# EAGLE design VNC2 (EAGLE 7.6.0)
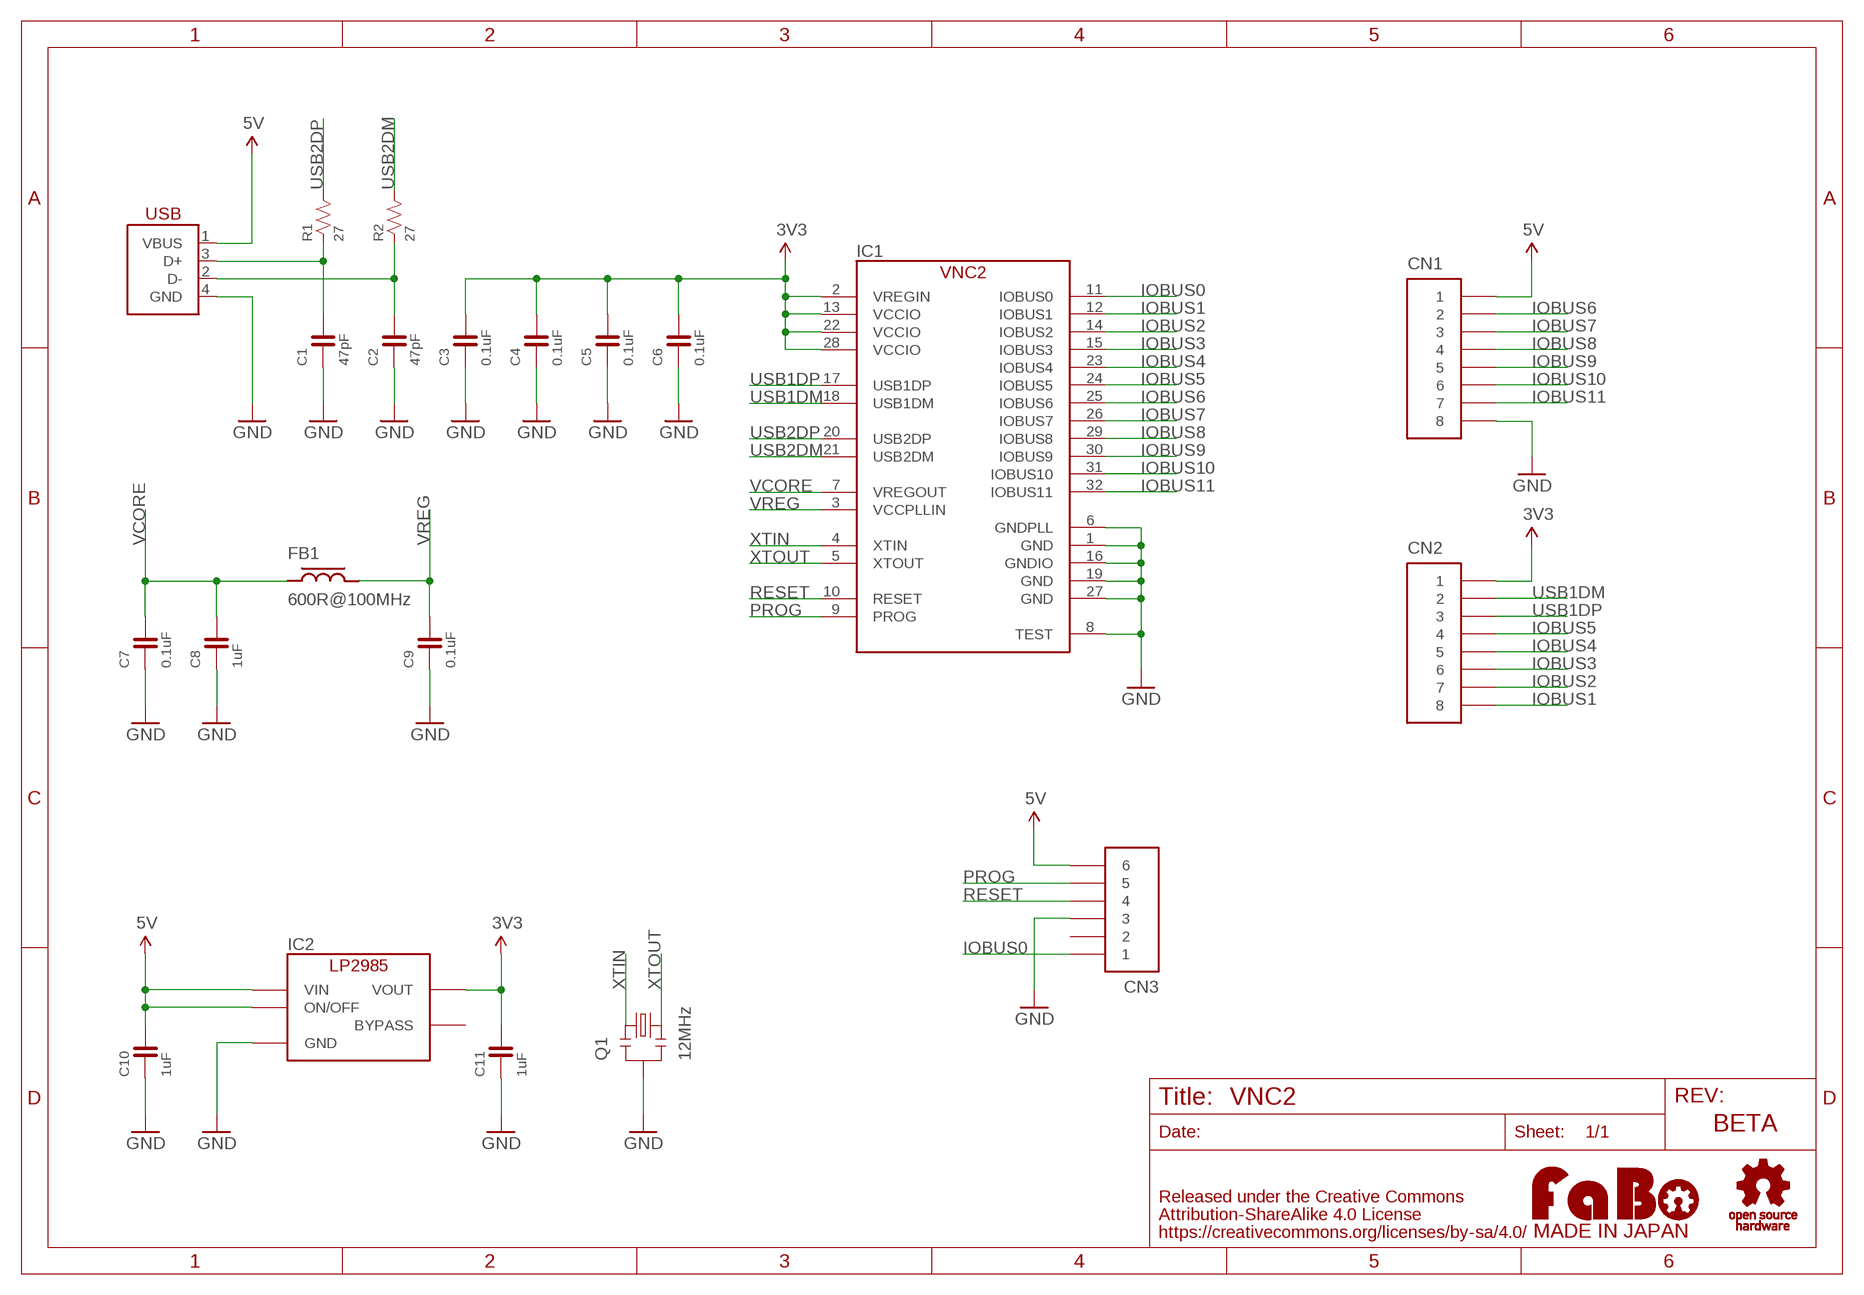
[diagram p0: schematic, sheet 1]

## Parts
C1  47pF  CAPACITOR-0603_NARROW  [0603-NARROW]
C2  47pF  CAPACITOR-0603_NARROW  [0603-NARROW]
C3  0.1uF  CAPACITOR-0603_NARROW  [0603-NARROW]
C4  0.1uF  CAPACITOR-0603_NARROW  [0603-NARROW]
C5  0.1uF  CAPACITOR-0603_NARROW  [0603-NARROW]
C6  0.1uF  CAPACITOR-0603_NARROW  [0603-NARROW]
C7  0.1uF  CAPACITOR-0603_NARROW  [0603-NARROW]
C8  1uF  CAPACITOR-0603_NARROW  [0603-NARROW]
C9  0.1uF  CAPACITOR-0603_NARROW  [0603-NARROW]
C10  1uF  CAPACITOR-0603_NARROW  [0603-NARROW]
C11  1uF  CAPACITOR-0603_NARROW  [0603-NARROW]
CN1  PIN_HEADER_1X8-SNEAKY  [PIN_1X8_SNEAKY]
CN2  PIN_HEADER_1X8-SNEAKY  [PIN_1X8_SNEAKY]
CN3  PIN_HEADER_1X6-SNEAKY  [PIN_1X6_SNEAKY]
FB1  600R@100MHz  FERRITEBEADS  [EIA0603]
IC1  VNC2-32Q1B  [QFN-32_VNC2]
IC2  LP2985-33DBV  [SOT-23-5]
Q1  12MHz  RESONATOR-CSTCE_G  [CSTCE_G]
R1  27  RESISTOR-0603-NARROW  [0603-NARROW]
R2  27  RESISTOR-0603-NARROW  [0603-NARROW]
U$2  LOGO_FABO-S_BOTTOM  [LOGO_FABO_S_BOTTOM]
U$3  LOGO_OSHW-S_BOTTOM  [LOGO_OSHW_S_BOTTOM]
USB1  USB-B_PTH  [USB-4AF103BS]

## Nets
3V3: C3.2 C4.2 C5.2 C6.2 C11.2 CN2.1 IC1.2(VREGIN) IC1.13(VCCIO) IC1.22(VCCIO) IC1.28(VCCIO) IC2.5(VOUT)
5V: C10.2 CN1.1 CN3.6 IC2.1(VIN) IC2.3(ON/OFF) USB1.1(VBUS)
GND: C1.1 C2.1 C3.1 C4.1 C5.1 C6.1 C7.1 C8.1 C9.1 C10.1 C11.1 CN1.8 CN3.3 IC1.1(GND) IC1.6(GNDPLL) IC1.8(TEST) IC1.16(GNDIO) IC1.19(GND) IC1.27(GND) IC2.2(GND) Q1.2 USB1.4(GND)
IOBUS0: CN3.1 IC1.11(IOBUS0)
IOBUS1: CN2.8 IC1.12(IOBUS1)
IOBUS2: CN2.7 IC1.14(IOBUS2)
IOBUS3: CN2.6 IC1.15(IOBUS3)
IOBUS4: CN2.5 IC1.23(IOBUS4)
IOBUS5: CN2.4 IC1.24(IOBUS5)
IOBUS6: CN1.2 IC1.25(IOBUS6)
IOBUS7: CN1.3 IC1.26(IOBUS7)
IOBUS8: CN1.4 IC1.29(IOBUS8)
IOBUS9: CN1.5 IC1.30(IOBUS9)
IOBUS10: CN1.6 IC1.31(IOBUS10)
IOBUS11: CN1.7 IC1.32(IOBUS11)
N$3: C1.2 R1.1 USB1.3(D+)
N$4: C2.2 R2.1 USB1.2(D-)
PROG: CN3.5 IC1.9(PROG)
RESET: CN3.4 IC1.10(RESET)
USB1DM: CN2.2 IC1.18(USB1DM)
USB1DP: CN2.3 IC1.17(USB1DP)
USB2DM: IC1.21(USB2DM) R2.2
USB2DP: IC1.20(USB2DP) R1.2
VCORE: C7.2 C8.2 FB1.1 IC1.7(VREGOUT)
VREG: C9.2 FB1.2 IC1.3(VCCPLLIN)
XTIN: IC1.4(XTIN) Q1.1
XTOUT: IC1.5(XTOUT) Q1.3
Unconnected: CN3.2 IC2.4(BYPASS)

## Notes on the sheet
- BETA

## Library data of the parts
C1-C11 = FaBo-Capacitor:CAPACITOR: CAPACITOR
CN1 CN2 = FaBo-PIN:PIN_HEADER_1X8
CN3 = FaBo-PIN:PIN_HEADER_1X6
FB1 = FaBo-etc:FERRITEBEADS
IC1 = FaBo-USB:VNC2-32
IC2 = FaBo-Supply:LP2985: LP2985
Q1 = FaBo-etc:RESONATOR: RESONATOR
R1 R2 = FaBo-Resistors:RESISTOR: RESISTOR
U$2 = FaBo-etc:LOGO_FABO
U$3 = FaBo-etc:LOGO_OSHW
USB1 = FaBo-USB:USB

## Board
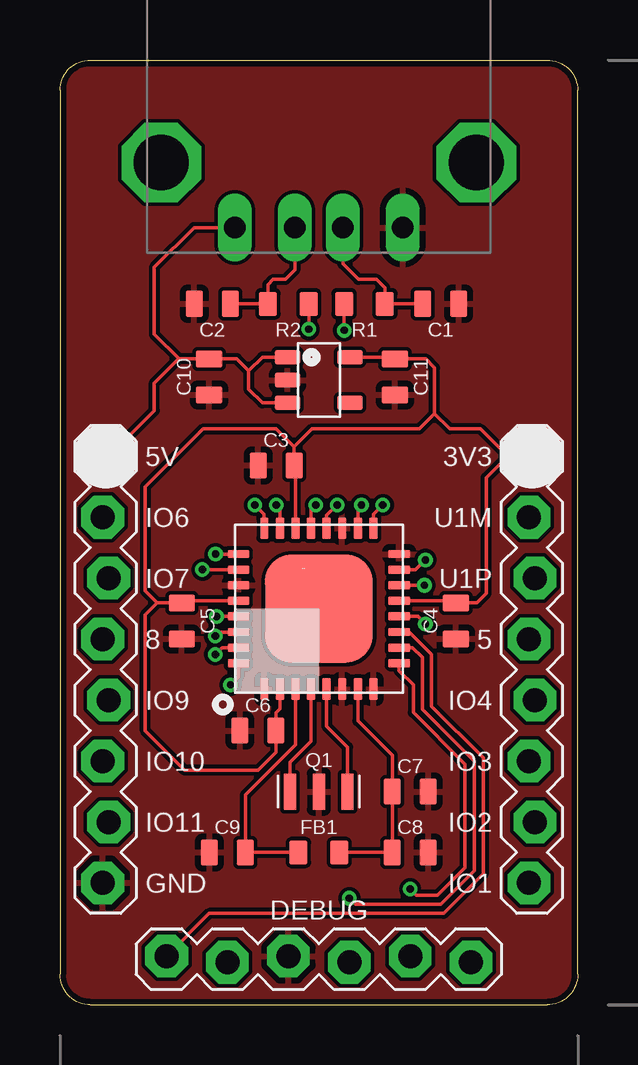
[diagram p1: board, top side]
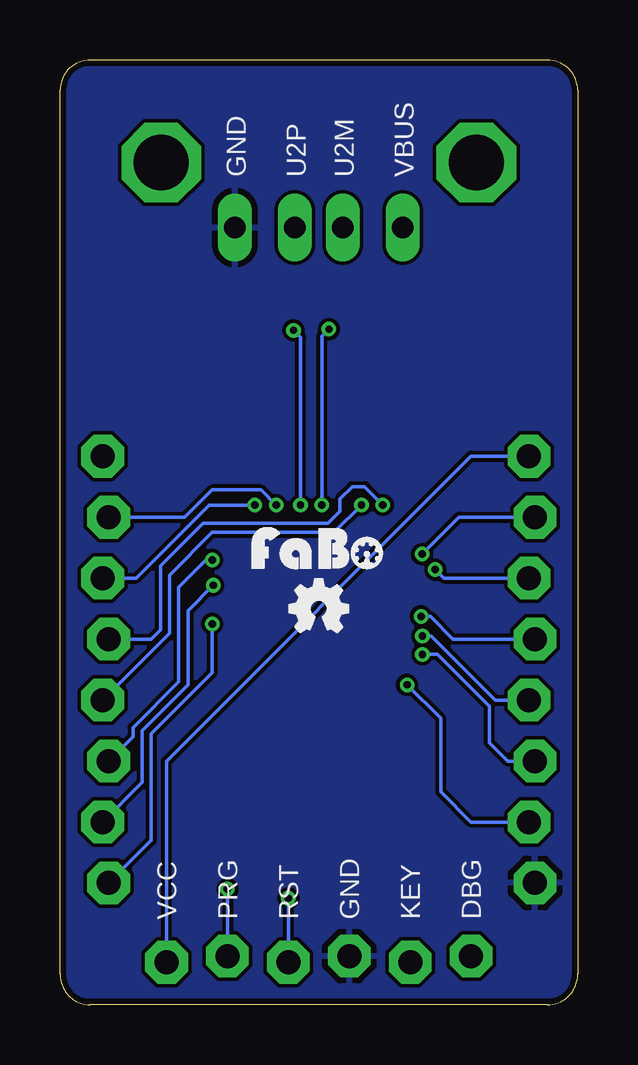
[diagram p2: board, bottom side, seen from below]

Size 21.59 x 39.37 mm. Coordinates in mm from the lower left corner, seen from the top.
Outline: 21.59,1.27 21.59,38.1 arc90 20.32,39.37 1.27,39.37 arc90 0,38.1 0,1.27 arc90 1.27,0 20.32,0 arc90 21.59,1.27
Copper layers (1*16): Top 0.035mm / dielectric 1.5mm / Bottom 0.035mm
Design rules "Elecrow_angle": minimum track width 6mil, minimum drill 12mil, track to track 6mil, track to pad 6mil, pad to pad 6mil, via to via 6mil, smd to smd 0mil, copper to edge 10mil, drill to drill 10mil, minimum pad ring 10mil, minimum via ring 6mil, stop-mask expansion 2mil, vias tented up to drill 100mil, thermal gap 10mil

### Footprints (pad centres in the part's own frame; a part is rotated, then mirrored left to right if it is on the bottom)
0603-NARROW = smd 0.71 x 1.09: 1 -0.75,0; 2 0.75,0
PIN_1X8_SNEAKY = drill 1 pad 1.778 octagon: 1 -8.89,0.127; 2 -6.35,-0.127; 3 -3.81,0.127; 4 -1.27,-0.127; 5 1.27,0.127; 6 3.81,-0.127; 7 6.35,0.127; 8 8.89,-0.127
PIN_1X6_SNEAKY = drill 1 pad 1.778 octagon: 1 -6.35,0.127; 2 -3.81,-0.127; 3 -1.27,0.127; 4 1.27,-0.127; 5 3.81,0.127; 6 6.35,-0.127
EIA0603 = smd 0.75 x 1: 1 -0.85,0; 2 0.85,0
QFN-32_VNC2 = smd 0.35 x 0.9: 1 -2.275,-3.35; 2 -1.625,-3.35; 3 -0.975,-3.35; 4 -0.325,-3.35; 5 0.325,-3.35; 6 0.975,-3.35; 7 1.625,-3.35; 8 2.275,-3.35; 17 2.275,3.35; 18 1.625,3.35; 19 0.975,3.35; 20 0.325,3.35; 21 -0.325,3.35; 22 -0.975,3.35; 23 -1.625,3.35; 24 -2.275,3.35 | smd 0.9 x 0.35: 9 3.35,-2.275; 10 3.35,-1.625; 11 3.35,-0.975; 12 3.35,-0.325; 13 3.35,0.325; 14 3.35,0.975; 15 3.35,1.625; 16 3.35,2.275; 25 -3.35,2.275; 26 -3.35,1.625; 27 -3.35,0.975; 28 -3.35,0.325; 29 -3.35,-0.325; 30 -3.35,-0.975; 31 -3.35,-1.625; 32 -3.35,-2.275 | smd 4.5 x 4.5: P$1 0,0
SOT-23-5 = smd 0.6 x 1.05: 1 -0.95,-1.3; 2 0,-1.3; 3 0.95,-1.3; 4 0.95,1.3; 5 -0.95,1.3
CSTCE_G = smd 0.5 x 1.5: 1 -1.2,0; 2 0,0; 3 1.2,0
0603-NARROW' = smd 0.75 x 1: 1 -0.85,0; 2 0.85,0
USB-4AF103BS = drill 0.9 long: 1 -3.5,0; 2 -1,0; 3 1,0; 4 3.5,0 | drill 2.3 octagon: P$1 -6.57,2.71; P$2 6.57,2.71

### Placement (x,y rotation side)
C1  15.88,29.21 180 top
C2  6.35,29.21 0 top
C3  9.02,22.48 0 top
C4  16.51,16 90 top
C5  5.08,16 90 top
C6  8.26,11.43 0 top
C7  14.61,8.89 180 top
C8  14.61,6.35 180 top
C9  6.99,6.35 0 top
C10  6.22,26.16 90 top
C11  13.97,26.16 90 top
CN1  1.91,13.97 270 top
CN2  19.68,13.97 270 top
CN3  10.79,1.91 0 top
FB1  10.79,6.35 180 top
IC1  10.79,16.51 0 top
IC2  10.79,26.04 270 top
Q1  10.79,8.89 0 top
R1  27  [0603-NARROW']  12.7,29.21 180 top
R2  27  [0603-NARROW']  9.53,29.21 0 top
U$2  10.79,18.16 0 top
U$3  10.79,16.51 0 top
USB1  10.79,32.38 0 top

### Tracks (layer width: path | path; a pad name or v marks a point on that pad's centre or on a via)
3V3
  Top 0.152: IC1.13 16.43,16.84 C4.2 17.39,16.75 17.78,17.14 17.78,21.97 18.67,22.86 | IC1.28 5.16,16.84 C5.2 4.05,16.75 | 4.05,16.75 3.56,16.26 3.56,11.43 5.21,9.78 8.26,9.78 9.01,10.53 C6.2 9.01,12.18 9.17,12.35 IC1.2 | 4.05,16.75 3.56,17.25 3.56,21.59 5.97,24 9.02,24 9.77,23.25 | 9.77,23.25 C3.2 9.82,22.43 IC1.22 | 9.77,23.25 10.52,24 14.99,24 15.62,24.64 | IC2.5 13.9,26.98 C11.2 15.25,26.91 15.62,26.54 15.62,24.64 | 18.67,22.86 CN2.1 | 18.67,22.86 17.53,24 16.26,24 15.62,24.64
5V
  Top 0.152: IC2.3 8.44,25.09 7.87,25.65 7.87,26.42 | IC2.1 8.44,26.98 7.87,26.42 | 7.87,26.42 7.37,26.92 6.24,26.92 C10.2 4.96,26.91 | USB1.1 5.59,32.38 3.94,30.73 3.94,27.94 4.96,26.91 | 4.96,26.91 4.94,26.91 3.94,25.91 3.94,24.77 CN1.1
  Bottom 0.152: CN3.6 17.14,10.16 4.45,22.86 CN1.1
GND
  pour Bottom: 0,0 21.59,0 21.59,39.37 0,39.37
  pour Top: 0,0 21.59,0 21.59,39.37 0,39.37
IOBUS0
  Top 0.152: IC1.11 14.56,15.54 15.49,14.61 15.49,12.45 17.65,10.29 17.65,5.46 16,3.81 6.22,3.81 CN3.1
IOBUS1  (via drill 0.3)
  Top 0.152: IC1.12 14.93,16.18 v15.24,15.88
  Bottom 0.152: v15.24,15.88 15.24,13.84 17.78,11.3 17.78,6.86 CN2.8
IOBUS2  (via drill 0.3)
  Top 0.152: IC1.14 v15.2,17.48
  Bottom 0.152: CN2.7 18.16,9.27 18.16,11.43 16.26,13.34 16.26,16.43 v15.2,17.48
IOBUS3  (via drill 0.3)
  Top 0.152: IC1.15 14.83,18.14 v15.24,18.54
  Bottom 0.152: CN2.6 18.54,11.18 18.54,11.56 16.64,13.46 16.64,17.4 15.49,18.54 v15.24,18.54
IOBUS4  (via drill 0.3)
  Top 0.152: IC1.23 9.17,20.68 v9.02,20.83
  Bottom 0.152: v9.02,20.83 10.16,19.68 15.24,19.68 17.02,17.91 17.02,15.49 CN2.5
IOBUS5  (via drill 0.3)
  Top 0.152: IC1.24 8.52,20.44 v8.13,20.83
  Bottom 0.152: CN2.4 17.78,15.24 17.4,15.62 17.4,18.29 15.62,20.07 10.41,20.07 9.91,20.57 9.91,21.08 9.4,21.59 8.89,21.59 v8.13,20.83
IOBUS6  (via drill 0.3)
  Top 0.152: IC1.25 v6.49,18.79
  Bottom 0.152: v6.49,18.79 4.95,20.32 CN1.2
IOBUS7  (via drill 0.3)
  Top 0.152: IC1.26 v5.94,18.14
  Bottom 0.152: v5.94,18.14 5.59,17.78 CN1.3
IOBUS8  (via drill 0.3)
  Top 0.152: IC1.29 v6.53,16.18
  Bottom 0.152: CN1.4 5.21,15.24 6.15,16.18 v6.53,16.18
IOBUS9  (via drill 0.3)
  Top 0.152: IC1.30 6.64,15.54 v6.48,15.37
  Bottom 0.152: v6.48,15.37 6.1,15.37 3.43,12.7 CN1.5
IOBUS10  (via drill 0.3)
  Top 0.152: IC1.31 6.76,14.88 v6.48,14.61
  Bottom 0.152: CN1.6 2.92,10.16 3.68,10.92 3.68,12.45 5.84,14.61 v6.48,14.61
IOBUS11  (via drill 0.3)
  Top 0.152: IC1.32 7.45,13.67 v7.11,13.34
  Bottom 0.152: CN1.7 4.45,7.62 5.71,8.89 5.71,11.94 v7.11,13.34
N$3
  Top 0.152: USB1.3 11.79,30.88 12.45,30.23 13.21,30.23 13.55,29.88 R1.1 C1.2
N$4
  Top 0.152: USB1.2 9.79,30.62 9.4,30.23 8.89,30.23 8.68,30.01 R2.1 C2.2
PROG  (via drill 0.3)
  Top 0.152: IC1.9 14.14,13.92 14.73,13.34 14.73,12.19 16.89,10.03 16.89,5.71 15.75,4.57 14.86,4.57 v14.61,4.83
  Bottom 0.152: v14.61,4.83 CN3.5
RESET  (via drill 0.3)
  Top 0.152: IC1.10 14.71,14.88 15.11,14.48 15.11,12.32 17.27,10.16 17.27,5.59 15.88,4.19 12.32,4.19 v12.06,4.45
  Bottom 0.152: CN3.4 v12.06,4.45
USB1DM  (via drill 0.3)
  Top 0.152: IC1.18 12.42,20.68 v12.57,20.83
  Bottom 0.152: CN2.2 16.38,20.32 15.24,21.46 13.21,21.46 v12.57,20.83
USB1DP  (via drill 0.3)
  Top 0.152: IC1.17 13.07,20.44 v13.46,20.83
  Bottom 0.152: CN2.3 18.41,17.78 15.37,20.83 v13.46,20.83
USB2DM  (via drill 0.3)
  Top 0.152: IC1.21 10.47,20.63 v10.67,20.83 | R2.2 v10.38,28.16
  Bottom 0.152: v10.67,20.83 10.67,27.86 v10.38,28.16
USB2DP  (via drill 0.3)
  Top 0.152: IC1.20 11.12,20.39 v11.56,20.83 | R1.2 v11.85,28.11
  Bottom 0.152: v11.56,20.83 11.56,27.81 v11.85,28.11
VCORE
  Top 0.152: FB1.1 C8.2 C7.2 13.86,10.4 12.42,11.84 IC1.7
VREG
  Top 0.152: IC1.3 9.82,10.84 7.74,8.75 C9.2 FB1.2
XTIN
  Top 0.152: Q1.1 9.6,10.1 10.47,10.98 IC1.4
XTOUT
  Top 0.152: IC1.5 11.12,11.61 11.99,10.74 Q1.3

### Text on the board
tPlace: 5V | 3V3 | IO6 | U1M | IO7 | U1P | 8 | 5 | IO9 | IO4 | IO10 | IO3 | IO11 | IO2 | GND | IO1 | DEBUG
bPlace: VBUS | U2M | U2P | GND | DBG | KEY | GND | RST | PRG | VCC